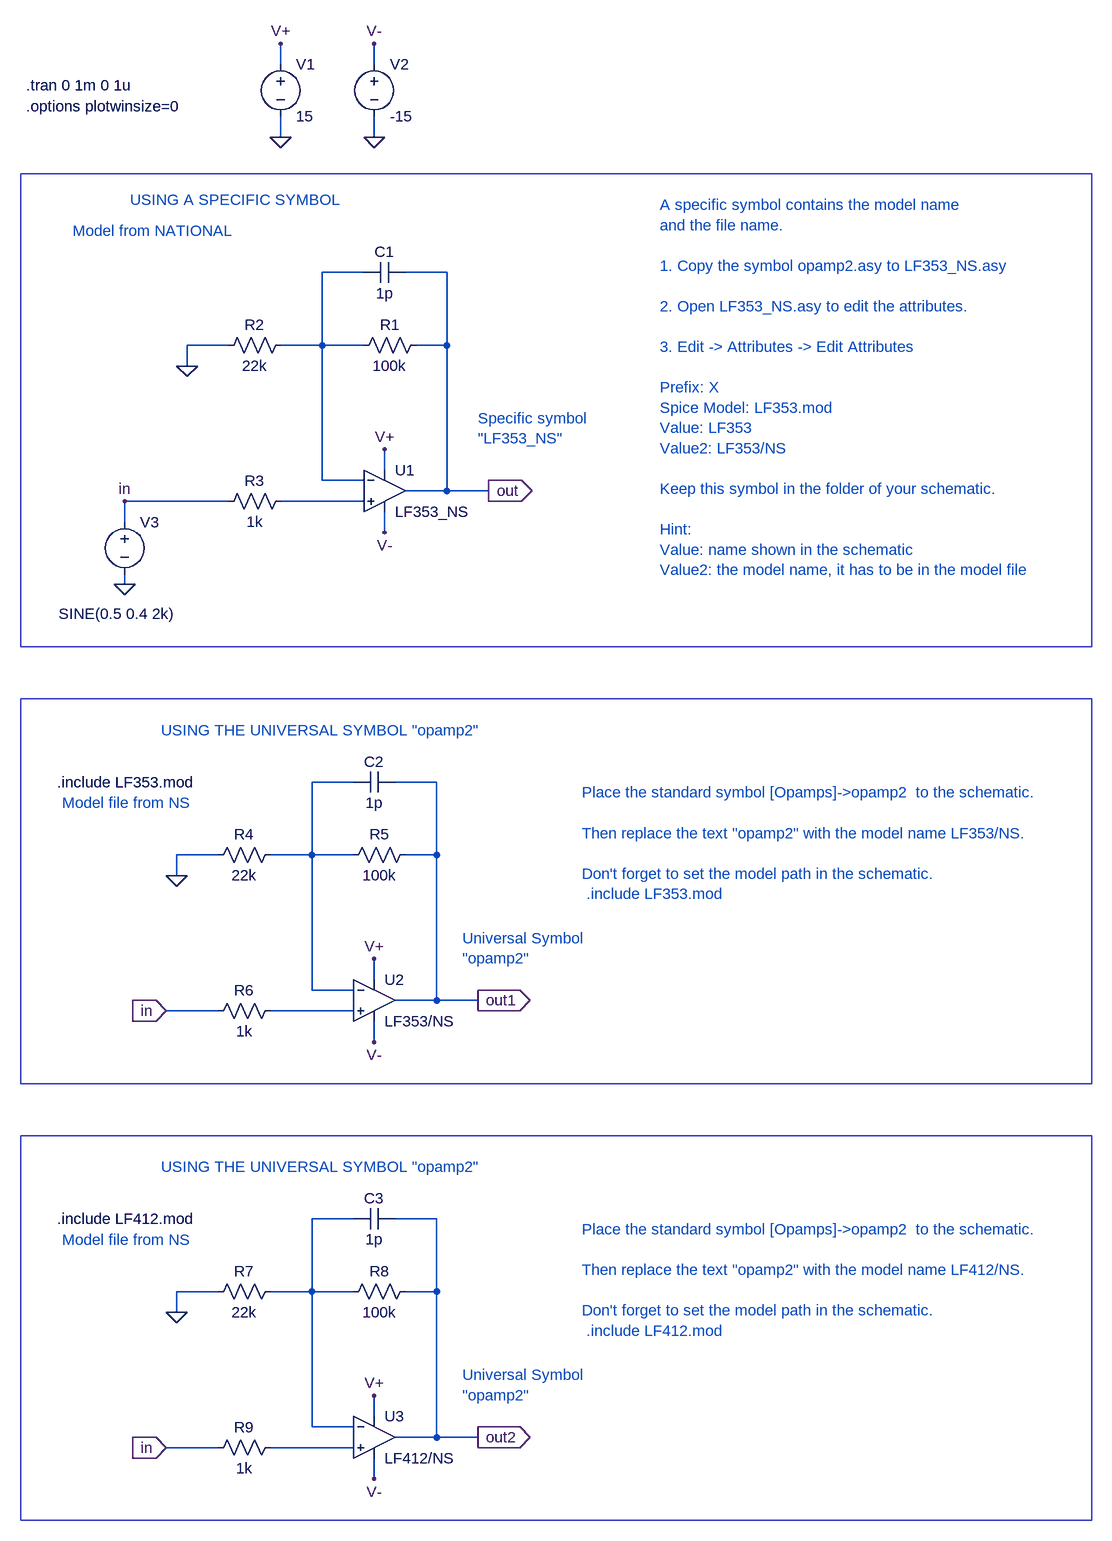
[diagram p0: schematic LF353_LF412_test.asc]
LF353_LF412_test.asc, the LTspice schematic file:
Version 4
SHEET 1 1464 1800
WIRE -32 -448 -32 -480
WIRE 112 -448 112 -480
WIRE -32 -336 -32 -368
WIRE 112 -336 112 -368
WIRE 96 -128 32 -128
WIRE 224 -128 160 -128
WIRE -112 -16 -176 -16
WIRE 32 -16 32 -128
WIRE 32 -16 -32 -16
WIRE 96 -16 32 -16
WIRE 224 -16 224 -128
WIRE 224 -16 176 -16
WIRE -176 16 -176 -16
WIRE 128 176 128 144
WIRE 32 192 32 -16
WIRE 96 192 32 192
WIRE 224 208 224 -16
WIRE 224 208 160 208
WIRE 288 208 224 208
WIRE -112 224 -272 224
WIRE 96 224 -32 224
WIRE -272 256 -272 224
WIRE 128 272 128 240
WIRE -272 352 -272 336
WIRE 80 656 16 656
WIRE 208 656 144 656
WIRE -128 768 -192 768
WIRE 16 768 16 656
WIRE 16 768 -48 768
WIRE 80 768 16 768
WIRE 208 768 208 656
WIRE 208 768 160 768
WIRE -192 800 -192 768
WIRE 112 960 112 928
WIRE 16 976 16 768
WIRE 80 976 16 976
WIRE 208 992 208 768
WIRE 208 992 144 992
WIRE 272 992 208 992
WIRE -128 1008 -208 1008
WIRE 80 1008 -48 1008
WIRE 112 1056 112 1024
WIRE 80 1328 16 1328
WIRE 208 1328 144 1328
WIRE -128 1440 -192 1440
WIRE 16 1440 16 1328
WIRE 16 1440 -48 1440
WIRE 80 1440 16 1440
WIRE 208 1440 208 1328
WIRE 208 1440 160 1440
WIRE -192 1472 -192 1440
WIRE 112 1632 112 1600
WIRE 16 1648 16 1440
WIRE 80 1648 16 1648
WIRE 208 1664 208 1440
WIRE 208 1664 144 1664
WIRE 272 1664 208 1664
WIRE -128 1680 -208 1680
WIRE 80 1680 -48 1680
WIRE 112 1728 112 1696
FLAG -32 -336 0
FLAG -272 352 0
FLAG 288 208 out
IOPIN 288 208 Out
FLAG -272 224 in
FLAG 128 144 V+
FLAG -32 -480 V+
FLAG -176 16 0
FLAG 272 992 out1
IOPIN 272 992 Out
FLAG 112 928 V+
FLAG -192 800 0
FLAG -208 1008 in
IOPIN -208 1008 In
FLAG 112 -336 0
FLAG 112 -480 V-
FLAG 128 272 V-
FLAG 112 1056 V-
FLAG 272 1664 out2
IOPIN 272 1664 Out
FLAG 112 1600 V+
FLAG -192 1472 0
FLAG -208 1680 in
IOPIN -208 1680 In
FLAG 112 1728 V-
SYMBOL voltage -32 -464 R0
WINDOW 123 0 0 Left 0
WINDOW 39 0 0 Left 0
SYMATTR InstName V1
SYMATTR Value 15
SYMBOL res -16 -32 R90
WINDOW 0 0 56 VBottom 0
WINDOW 3 32 56 VTop 0
SYMATTR InstName R2
SYMATTR Value 22k
SYMBOL voltage -272 240 R0
WINDOW 3 -102 157 Left 0
WINDOW 123 0 0 Left 0
WINDOW 39 0 0 Left 0
SYMATTR Value SINE(0.5 0.4 2k)
SYMATTR InstName V3
SYMBOL cap 160 -144 R90
WINDOW 0 0 32 VBottom 0
WINDOW 3 32 32 VTop 0
SYMATTR InstName C1
SYMATTR Value 1p
SYMBOL res 192 -32 R90
WINDOW 0 0 56 VBottom 0
WINDOW 3 32 56 VTop 0
SYMATTR InstName R1
SYMATTR Value 100k
SYMBOL res -128 240 R270
WINDOW 0 32 56 VTop 0
WINDOW 3 0 56 VBottom 0
SYMATTR InstName R3
SYMATTR Value 1k
SYMBOL res -32 752 R90
WINDOW 0 0 56 VBottom 0
WINDOW 3 32 56 VTop 0
SYMATTR InstName R4
SYMATTR Value 22k
SYMBOL cap 144 640 R90
WINDOW 0 0 32 VBottom 0
WINDOW 3 32 32 VTop 0
SYMATTR InstName C2
SYMATTR Value 1p
SYMBOL res 176 752 R90
WINDOW 0 0 56 VBottom 0
WINDOW 3 32 56 VTop 0
SYMATTR InstName R5
SYMATTR Value 100k
SYMBOL res -144 1024 R270
WINDOW 0 32 56 VTop 0
WINDOW 3 0 56 VBottom 0
SYMATTR InstName R6
SYMATTR Value 1k
SYMBOL voltage 112 -464 R0
WINDOW 123 0 0 Left 0
WINDOW 39 0 0 Left 0
SYMATTR InstName V2
SYMATTR Value -15
SYMBOL LF353_NS 128 144 R0
SYMATTR InstName U1
SYMBOL Opamps\\opamp2 112 928 R0
SYMATTR InstName U2
SYMATTR Value LF353/NS
SYMBOL res -32 1424 R90
WINDOW 0 0 56 VBottom 0
WINDOW 3 32 56 VTop 0
SYMATTR InstName R7
SYMATTR Value 22k
SYMBOL cap 144 1312 R90
WINDOW 0 0 32 VBottom 0
WINDOW 3 32 32 VTop 0
SYMATTR InstName C3
SYMATTR Value 1p
SYMBOL res 176 1424 R90
WINDOW 0 0 56 VBottom 0
WINDOW 3 32 56 VTop 0
SYMATTR InstName R8
SYMATTR Value 100k
SYMBOL res -144 1696 R270
WINDOW 0 32 56 VTop 0
WINDOW 3 0 56 VBottom 0
SYMATTR InstName R9
SYMATTR Value 1k
SYMBOL Opamps\\opamp2 112 1600 R0
SYMATTR InstName U3
SYMATTR Value LF412/NS
TEXT -424 -416 Left 0 !.tran 0 1m 0 1u
TEXT -376 656 Left 0 !.include LF353.mod
TEXT 552 -232 Left 0 ;A specific symbol contains the model name \nand the file name.\n \n1. Copy the symbol opamp2.asy to LF353_NS.asy\n \n2. Open LF353_NS.asy to edit the attributes.\n \n3. Edit -> Attributes -> Edit Attributes\n \nPrefix: X\nSpice Model: LF353.mod\nValue: LF353\nValue2: LF353/NS\n \nKeep this symbol in the folder of your schematic.\n \nHint: \nValue: name shown in the schematic\nValue2: the model name, it has to be in the model file
TEXT -424 -384 Left 0 !.options plotwinsize=0
TEXT -368 688 Left 0 ;Model file from NS
TEXT 248 896 Left 0 ;Universal Symbol \n"opamp2"
TEXT 432 672 Left 0 ;Place the standard symbol [Opamps]->opamp2  to the schematic.\n \nThen replace the text "opamp2" with the model name LF353/NS. \n \nDon't forget to set the model path in the schematic.\n .include LF353.mod
TEXT -264 -240 Left 0 ;USING A SPECIFIC SYMBOL
TEXT -216 576 Left 0 ;USING THE UNIVERSAL SYMBOL "opamp2"
TEXT -352 -192 Left 0 ;Model from NATIONAL
TEXT 272 96 Left 0 ;Specific symbol\n"LF353_NS"
TEXT -376 1328 Left 0 !.include LF412.mod
TEXT -368 1360 Left 0 ;Model file from NS
TEXT 248 1568 Left 0 ;Universal Symbol \n"opamp2"
TEXT 432 1344 Left 0 ;Place the standard symbol [Opamps]->opamp2  to the schematic.\n \nThen replace the text "opamp2" with the model name LF412/NS. \n \nDon't forget to set the model path in the schematic.\n .include LF412.mod
TEXT -216 1248 Left 0 ;USING THE UNIVERSAL SYMBOL "opamp2"
RECTANGLE Normal 1216 448 -432 -280
RECTANGLE Normal 1216 1120 -432 528
RECTANGLE Normal 1216 1792 -432 1200

The netlist it stands for:
* LF353_LF412_test.asc
V1 V+ 0 15
R2 N001 0 22k
V3 in 0 SINE(0.5 0.4 2k)
C1 out N001 1p
R1 out N001 100k
R3 in N002 1k
R4 N003 0 22k
C2 out1 N003 1p
R5 out1 N003 100k
R6 in N004 1k
V2 V- 0 -15
* U1: LF353_NS (symbol LF353_NS not available, pins judged from their places): In+=N002 In-=N001 V+=V+ V-=V- OUT=out
XU2 N004 N003 V+ V- out1 LF353/NS  ; pins In+ In- V+ V- OUT
R7 N005 0 22k
C3 out2 N005 1p
R8 out2 N005 100k
R9 in N006 1k
XU3 N006 N005 V+ V- out2 LF412/NS  ; pins In+ In- V+ V- OUT
.tran 0 1m 0 1u
.include LF353.mod
* A specific symbol contains the model name
* and the file name.
* 1. Copy the symbol opamp2.asy to LF353_NS.asy
* 2. Open LF353_NS.asy to edit the attributes.
* 3. Edit -> Attributes -> Edit Attributes
* Prefix: X
* Spice Model: LF353.mod
* Value: LF353
* Value2: LF353/NS
* Keep this symbol in the folder of your schematic.
* Hint:
* Value: name shown in the schematic
* Value2: the model name, it has to be in the model file
.options plotwinsize=0
* Model file from NS
* Universal Symbol
* "opamp2"
* Place the standard symbol [Opamps]->opamp2  to the schematic.
* Then replace the text "opamp2" with the model name LF353/NS.
* Don't forget to set the model path in the schematic.
*  .include LF353.mod
* USING A SPECIFIC SYMBOL
* USING THE UNIVERSAL SYMBOL "opamp2"
* Model from NATIONAL
* Specific symbol
* "LF353_NS"
.include LF412.mod
* Model file from NS
* Universal Symbol
* "opamp2"
* Place the standard symbol [Opamps]->opamp2  to the schematic.
* Then replace the text "opamp2" with the model name LF412/NS.
* Don't forget to set the model path in the schematic.
*  .include LF412.mod
* USING THE UNIVERSAL SYMBOL "opamp2"
.backanno
.end